# EasyEDA Pro project MN42_v2base.eprj, board MOAR_Board
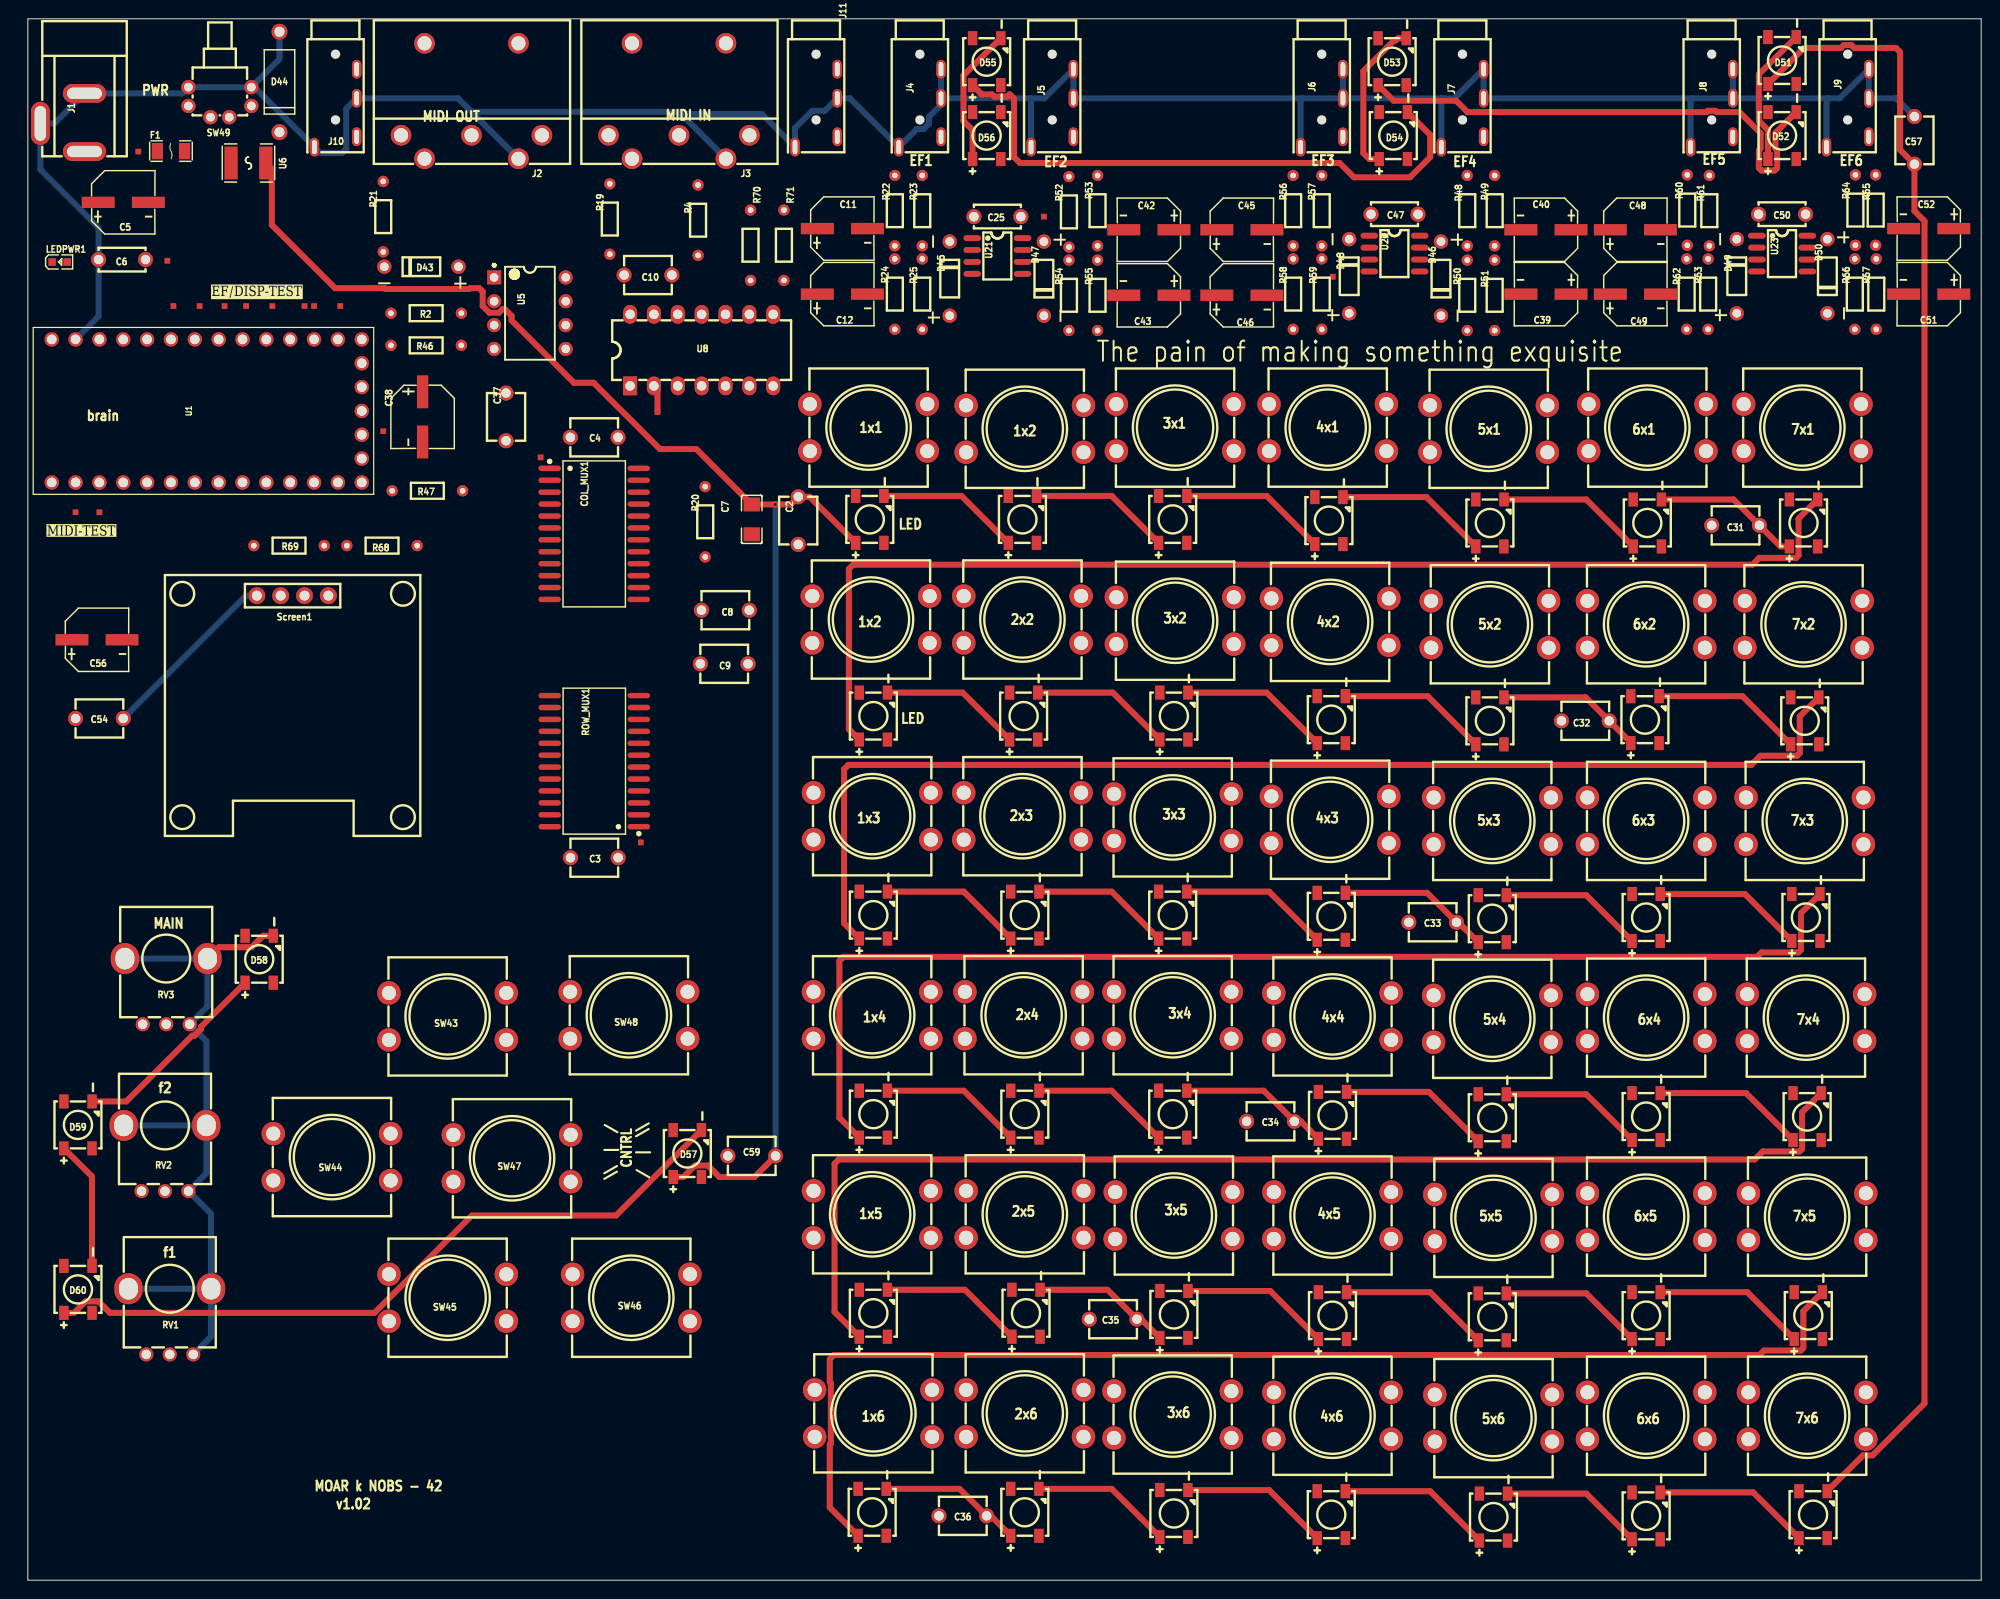
[diagram p3: board, top side]
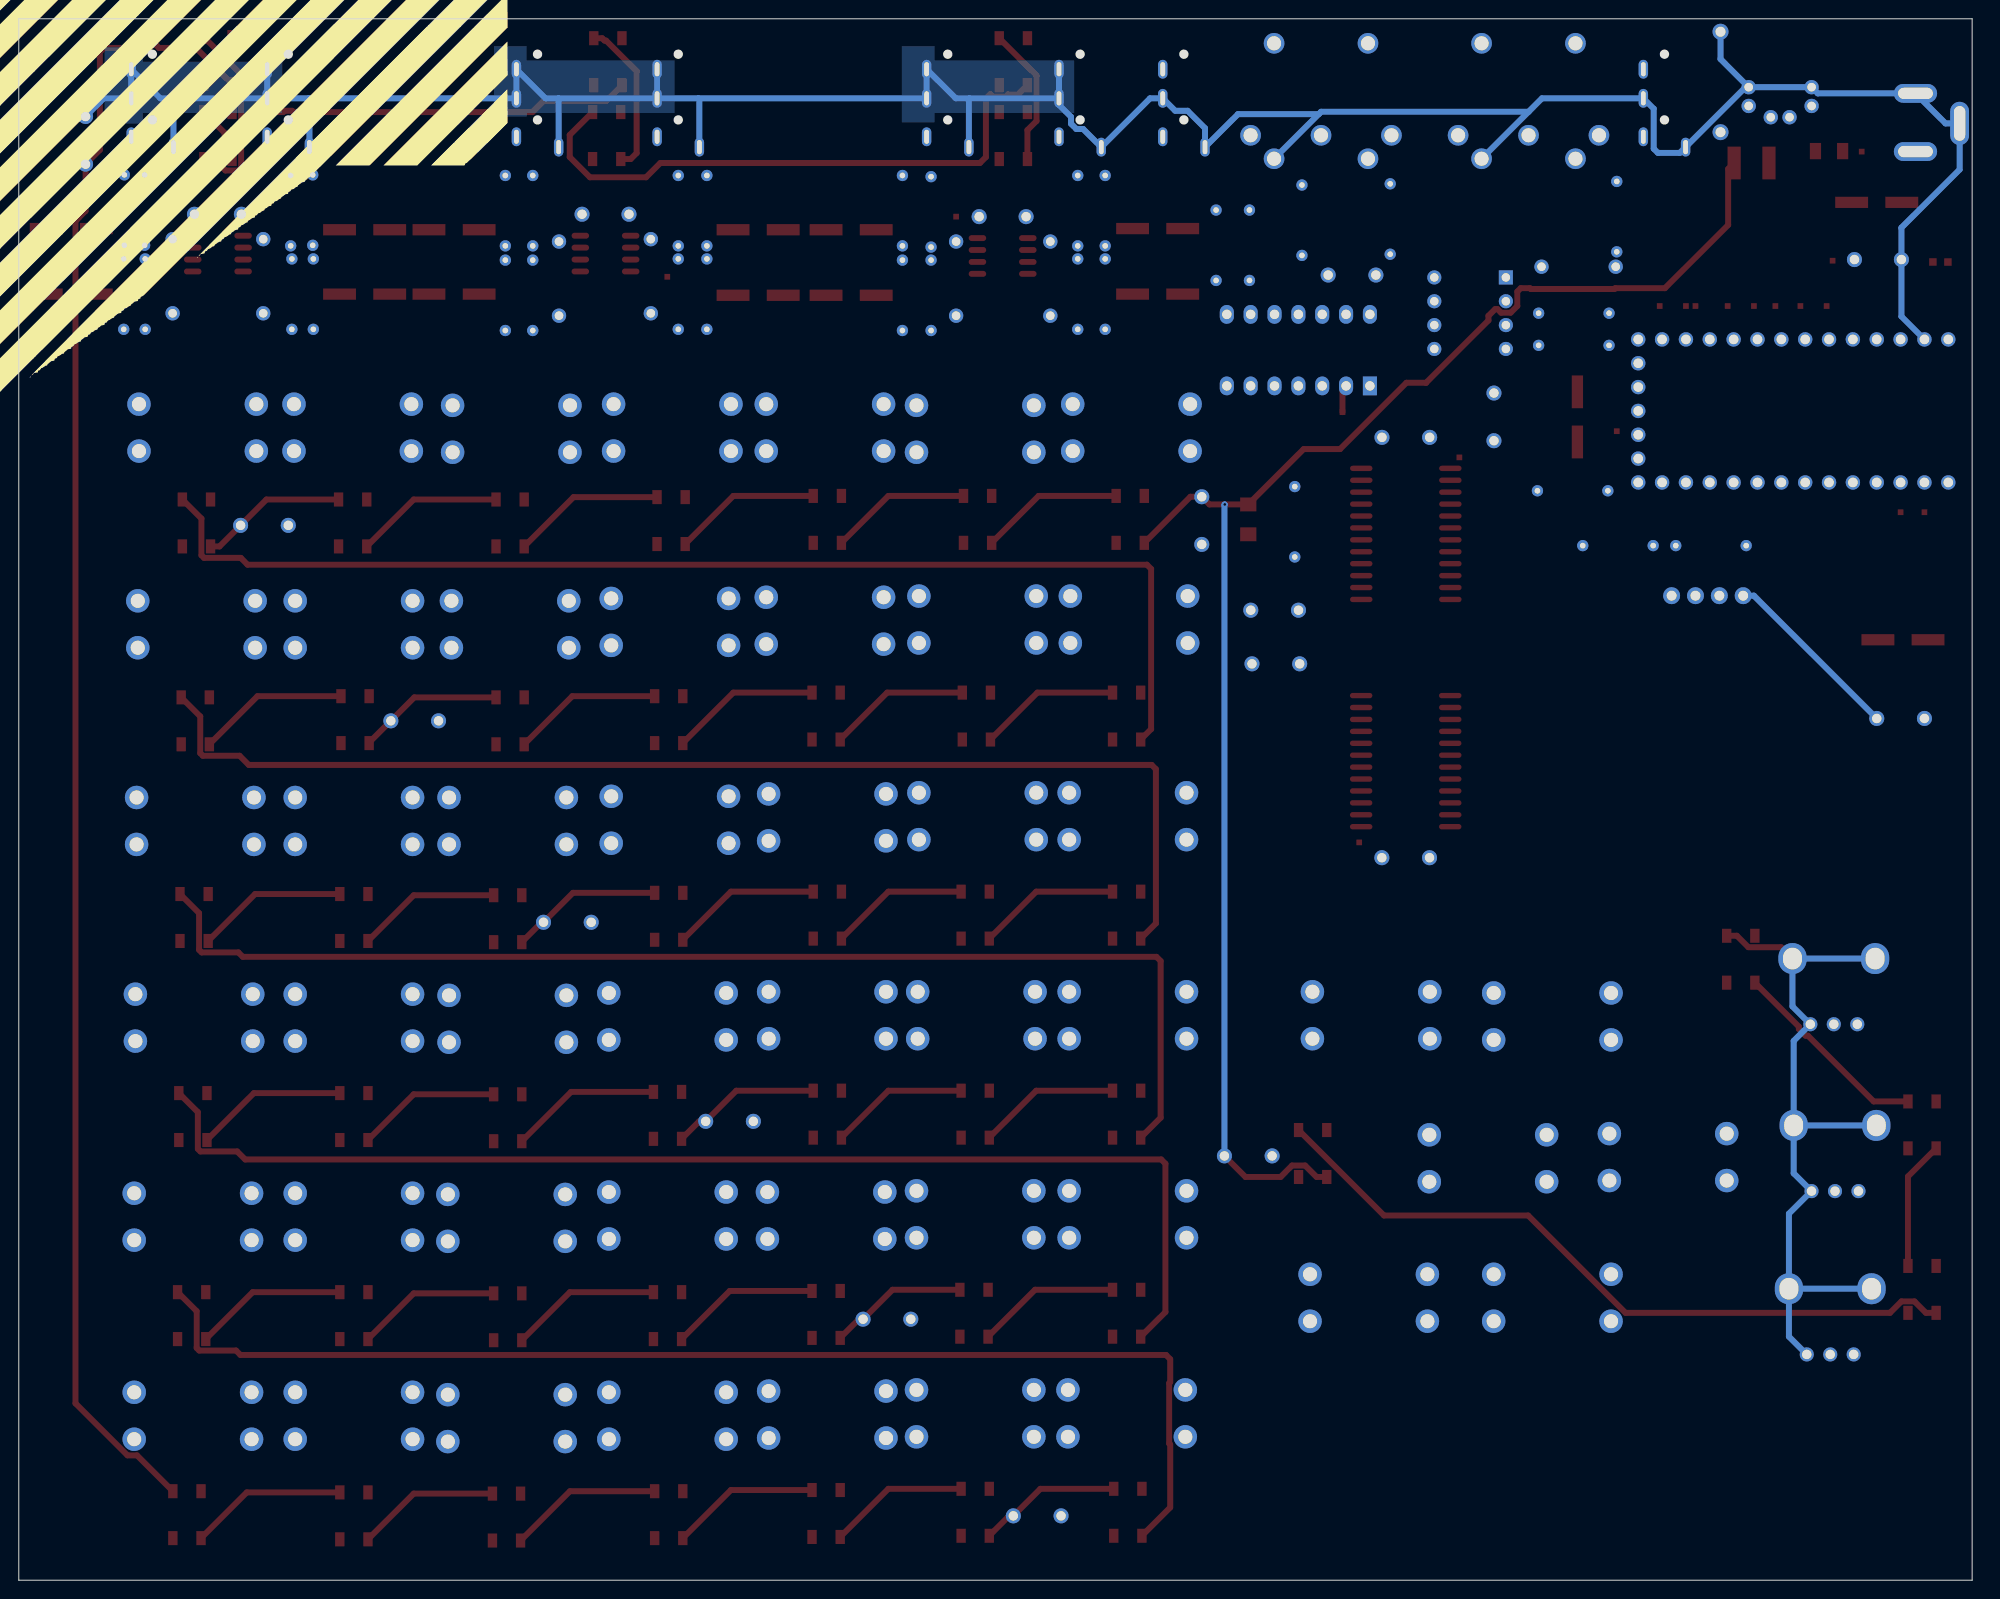
[diagram p4: board, bottom side, seen from below]

Outline 208.03 x 166.37 mm; copper layers: Top Layer, Bottom Layer. Coordinates in mm from the lower left corner of the outline.
Outline path: 0,166.37 0,0 208.03,0 208.03,166.37 0,166.37
Stack: Top Layer 0.035mm / Dielectric1 1.51mm FR4 er 4.5 / Bottom Layer 0.035mm

## Design rules (mm)
template: User Custom Config
spacing safeClearance (default): track to track 0.152, other pairs 0.152 to 0.3
track width trackWidth (default): min 0.127, default 0.254, max 2.54
differential pair differentialPair (default): width min 0.127, default 0.254, max 2.54; gap min 0.152, default 0.152
via viaSize (default): diameter min 0.5, default 0.61, max 10; hole min 0.3, default 0.305, max 5.999

## Placement (name value [footprint] x y rotation side)
C2  100nF  [CAP-TH_L5.0-W4.0-P5.00-D1.0]  82.04 112.9 270 top
C3  100nF  [CAP-TH_L5.0-W4.0-P5.00-D1.0]  60.33 76.98 0 top
C4  100nF  [CAP-TH_L5.0-W4.0-P5.00-D1.0]  60.31 121.77 0 top
C5  220uF  [CAP-SMD_BD6.3-L6.6-W6.6-FD]  10.16 146.81 0 top
C6  100nF  [CAP-TH_L5.0-W2.5-P5.00-D1.0]  10.03 140.72 0 top
C7  100uF  [C1206]  77.09 113.03 90 top
C8  1uF  [CAP-TH_L5.0-W4.0-P5.00-D1.0]  74.28 103.36 180 top
C9  100nF  [CAP-TH_L5.0-W4.0-P5.00-D1.0]  74.16 97.64 180 top
C10  100nF  [CAP-TH_L5.0-W4.0-P5.00-D1.0]  66.04 139.06 0 top
C11  1uF  [CAP-SMD_BD6.3-L6.6-W6.6-FD]  86.74 144.02 0 top
C12  1uF  [CAP-SMD_BD6.3-L6.6-W6.6-FD]  86.74 137.03 0 top
C25  100nF  [CAP-TH_L5.0-W2.5-P5.00-D1.0]  103.25 145.29 180 top
C31  100nF  [CAP-TH_L5.0-W4.0-P5.00-D1.0]  181.86 112.4 180 top
C32  100nF  [CAP-TH_L5.0-W4.0-P5.00-D1.0]  165.86 91.57 180 top
C33  100nF  [CAP-TH_L5.0-W4.0-P5.00-D1.0]  149.61 70.1 180 top
C34  100nF  [CAP-TH_L5.0-W4.0-P5.00-D1.0]  132.33 48.9 180 top
C35  100nF  [CAP-TH_L5.0-W4.0-P5.00-D1.0]  115.57 27.81 180 top
C36  100nF  [CAP-TH_L5.0-W4.0-P5.00-D1.0]  99.57 6.86 180 top
C37  100nF  [CAP-TH_L5.0-W4.0-P5.00-D1.0]  50.93 123.95 270 top
C38  4.7uF  [CAP-SMD_BD6.3-L6.6-W6.6-FD]  42.04 123.95 270 top
C39  1uF  [CAP-SMD_BD6.3-L6.6-W6.6-FD]  161.67 137.03 180 top
C40  1uF  [CAP-SMD_BD6.3-L6.6-W6.6-FD]  161.67 143.89 180 top
C42  1uF  [CAP-SMD_BD6.3-L6.6-W6.6-FD]  119.38 143.89 180 top
C43  1uF  [CAP-SMD_BD6.3-L6.6-W6.6-FD]  119.38 136.91 180 top
C45  1uF  [CAP-SMD_BD6.3-L6.6-W6.6-FD]  129.29 143.89 0 top
C46  1uF  [CAP-SMD_BD6.3-L6.6-W6.6-FD]  129.29 136.91 0 top
C47  100nF  [CAP-TH_L5.0-W2.5-P5.00-D1.0]  145.54 145.54 180 top
C48  1uF  [CAP-SMD_BD6.3-L6.6-W6.6-FD]  171.2 143.89 0 top
C49  1uF  [CAP-SMD_BD6.3-L6.6-W6.6-FD]  171.2 137.03 0 top
C50  100nF  [CAP-TH_L5.0-W2.5-P5.00-D1.0]  186.82 145.54 180 top
C51  1uF  [CAP-SMD_BD6.3-L6.6-W6.6-FD]  202.44 137.03 180 top
C52  1uF  [CAP-SMD_BD6.3-L6.6-W6.6-FD]  202.44 144.02 180 top
C54  1uF  [CAP-TH_L5.0-W4.0-P5.00-D1.0]  7.62 91.82 0 top
C56  10uF  [CAP-SMD_BD6.3-L6.6-W6.6-FD]  7.37 100.2 0 top
C57  100nF  [CAP-TH_L5.0-W4.0-P5.00-D1.0]  200.91 153.42 90 top
C59  100nF  [CAP-TH_L5.0-W4.0-P5.00-D1.0]  77.09 45.21 180 top
COL_MUX1  CD74HC4067M96  [SOIC-24_L15.4-W7.5-P1.27-LS10.3-BL]  60.31 111.48 270 top
D1  XL-5050RGBC-WS2812B  [LED-SMD_4P-L5.0-W5.0-BL_XL-5050RGBC]  89.66 113.03 0 top
D2  XL-5050RGBC-WS2812B  [LED-SMD_4P-L5.0-W5.0-BL_XL-5050RGBC]  105.92 113.03 0 top
D3  XL-5050RGBC-WS2812B  [LED-SMD_4P-L5.0-W5.0-BL_XL-5050RGBC]  121.92 113.03 0 top
D4  XL-5050RGBC-WS2812B  [LED-SMD_4P-L5.0-W5.0-BL_XL-5050RGBC]  138.56 112.9 0 top
D5  XL-5050RGBC-WS2812B  [LED-SMD_4P-L5.0-W5.0-BL_XL-5050RGBC]  155.7 112.65 0 top
D6  XL-5050RGBC-WS2812B  [LED-SMD_4P-L5.0-W5.0-BL_XL-5050RGBC]  172.47 112.65 0 top
D7  XL-5050RGBC-WS2812B  [LED-SMD_4P-L5.0-W5.0-BL_XL-5050RGBC]  189.1 112.65 0 top
D8  XL-5050RGBC-WS2812B  [LED-SMD_4P-L5.0-W5.0-BL_XL-5050RGBC]  90.04 92.08 0 top
D9  XL-5050RGBC-WS2812B  [LED-SMD_4P-L5.0-W5.0-BL_XL-5050RGBC]  106.05 92.08 0 top
D10  XL-5050RGBC-WS2812B  [LED-SMD_4P-L5.0-W5.0-BL_XL-5050RGBC]  122.05 92.08 0 top
D11  XL-5050RGBC-WS2812B  [LED-SMD_4P-L5.0-W5.0-BL_XL-5050RGBC]  138.81 91.69 0 top
D12  XL-5050RGBC-WS2812B  [LED-SMD_4P-L5.0-W5.0-BL_XL-5050RGBC]  155.7 91.57 0 top
D13  XL-5050RGBC-WS2812B  [LED-SMD_4P-L5.0-W5.0-BL_XL-5050RGBC]  172.21 91.69 0 top
D14  XL-5050RGBC-WS2812B  [LED-SMD_4P-L5.0-W5.0-BL_XL-5050RGBC]  189.23 91.57 0 top
D15  XL-5050RGBC-WS2812B  [LED-SMD_4P-L5.0-W5.0-BL_XL-5050RGBC]  90.04 70.87 0 top
D16  XL-5050RGBC-WS2812B  [LED-SMD_4P-L5.0-W5.0-BL_XL-5050RGBC]  106.17 70.87 0 top
D17  XL-5050RGBC-WS2812B  [LED-SMD_4P-L5.0-W5.0-BL_XL-5050RGBC]  121.92 70.87 0 top
D18  XL-5050RGBC-WS2812B  [LED-SMD_4P-L5.0-W5.0-BL_XL-5050RGBC]  138.81 70.74 0 top
D19  XL-5050RGBC-WS2812B  [LED-SMD_4P-L5.0-W5.0-BL_XL-5050RGBC]  155.96 70.49 0 top
D20  XL-5050RGBC-WS2812B  [LED-SMD_4P-L5.0-W5.0-BL_XL-5050RGBC]  172.34 70.61 0 top
D21  XL-5050RGBC-WS2812B  [LED-SMD_4P-L5.0-W5.0-BL_XL-5050RGBC]  189.36 70.61 0 top
D22  XL-5050RGBC-WS2812B  [LED-SMD_4P-L5.0-W5.0-BL_XL-5050RGBC]  90.04 49.66 0 top
D23  XL-5050RGBC-WS2812B  [LED-SMD_4P-L5.0-W5.0-BL_XL-5050RGBC]  106.17 49.66 0 top
D24  XL-5050RGBC-WS2812B  [LED-SMD_4P-L5.0-W5.0-BL_XL-5050RGBC]  121.92 49.66 0 top
D25  XL-5050RGBC-WS2812B  [LED-SMD_4P-L5.0-W5.0-BL_XL-5050RGBC]  138.94 49.53 0 top
D26  XL-5050RGBC-WS2812B  [LED-SMD_4P-L5.0-W5.0-BL_XL-5050RGBC]  155.96 49.28 0 top
D27  XL-5050RGBC-WS2812B  [LED-SMD_4P-L5.0-W5.0-BL_XL-5050RGBC]  172.34 49.4 0 top
D28  XL-5050RGBC-WS2812B  [LED-SMD_4P-L5.0-W5.0-BL_XL-5050RGBC]  189.48 49.4 0 top
D29  XL-5050RGBC-WS2812B  [LED-SMD_4P-L5.0-W5.0-BL_XL-5050RGBC]  90.04 28.45 0 top
D30  XL-5050RGBC-WS2812B  [LED-SMD_4P-L5.0-W5.0-BL_XL-5050RGBC]  106.3 28.45 0 top
D31  XL-5050RGBC-WS2812B  [LED-SMD_4P-L5.0-W5.0-BL_XL-5050RGBC]  122.05 28.32 0 top
D32  XL-5050RGBC-WS2812B  [LED-SMD_4P-L5.0-W5.0-BL_XL-5050RGBC]  138.94 28.19 0 top
D33  XL-5050RGBC-WS2812B  [LED-SMD_4P-L5.0-W5.0-BL_XL-5050RGBC]  155.96 28.07 0 top
D34  XL-5050RGBC-WS2812B  [LED-SMD_4P-L5.0-W5.0-BL_XL-5050RGBC]  172.34 28.19 0 top
D35  XL-5050RGBC-WS2812B  [LED-SMD_4P-L5.0-W5.0-BL_XL-5050RGBC]  189.61 28.19 0 top
D36  XL-5050RGBC-WS2812B  [LED-SMD_4P-L5.0-W5.0-BL_XL-5050RGBC]  89.92 7.24 0 top
D37  XL-5050RGBC-WS2812B  [LED-SMD_4P-L5.0-W5.0-BL_XL-5050RGBC]  106.17 7.24 0 top
D38  XL-5050RGBC-WS2812B  [LED-SMD_4P-L5.0-W5.0-BL_XL-5050RGBC]  122.05 7.11 0 top
D39  XL-5050RGBC-WS2812B  [LED-SMD_4P-L5.0-W5.0-BL_XL-5050RGBC]  138.81 6.99 0 top
D40  XL-5050RGBC-WS2812B  [LED-SMD_4P-L5.0-W5.0-BL_XL-5050RGBC]  156.08 6.73 0 top
D41  XL-5050RGBC-WS2812B  [LED-SMD_4P-L5.0-W5.0-BL_XL-5050RGBC]  172.34 6.86 0 top
D42  XL-5050RGBC-WS2812B  [LED-SMD_4P-L5.0-W5.0-BL_XL-5050RGBC]  190.12 6.99 0 top
D43  1N4148PF  [DO-35_BD1.9-L3.9-P7.90-D0.5-FD]  41.91 139.95 180 top
D44  SA6.0A  [DO-15_BD3.1-L6.7-P10.70-D0.8-RD]  26.8 159.64 90 top
D45  1N4148PF  [DO-35_BD1.9-L3.9-P7.90-D0.5-FD]  98.17 138.68 90 top
D46  1N4148PF  [DO-35_BD1.9-L3.9-P7.90-D0.5-FD]  150.5 138.68 270 top
D47  1N4148PF  [DO-35_BD1.9-L3.9-P7.90-D0.5-FD]  108.2 138.68 270 top
D48  1N4148PF  [DO-35_BD1.9-L3.9-P7.90-D0.5-FD]  140.72 138.94 90 top
D49  1N4148PF  [DO-35_BD1.9-L3.9-P7.90-D0.5-FD]  181.99 138.94 90 top
D50  1N4148PF  [DO-35_BD1.9-L3.9-P7.90-D0.5-FD]  191.64 138.94 270 top
D51  XL-5050RGBC-WS2812B  [LED-SMD_4P-L5.0-W5.0-BL_XL-5050RGBC]  186.82 161.93 0 top
D52  XL-5050RGBC-WS2812B  [LED-SMD_4P-L5.0-W5.0-BL_XL-5050RGBC]  186.82 153.92 0 top
D53  XL-5050RGBC-WS2812B  [LED-SMD_4P-L5.0-W5.0-BL_XL-5050RGBC]  145.29 161.8 0 top
D54  XL-5050RGBC-WS2812B  [LED-SMD_4P-L5.0-W5.0-BL_XL-5050RGBC]  145.42 153.92 0 top
D55  XL-5050RGBC-WS2812B  [LED-SMD_4P-L5.0-W5.0-BL_XL-5050RGBC]  102.11 161.8 0 top
D56  XL-5050RGBC-WS2812B  [LED-SMD_4P-L5.0-W5.0-BL_XL-5050RGBC]  102.11 153.92 0 top
D57  XL-5050RGBC-WS2812B  [LED-SMD_4P-L5.0-W5.0-BL_XL-5050RGBC]  70.23 45.47 0 top
D58  XL-5050RGBC-WS2812B  [LED-SMD_4P-L5.0-W5.0-BL_XL-5050RGBC]  24.64 66.17 0 top
D59  XL-5050RGBC-WS2812B  [LED-SMD_4P-L5.0-W5.0-BL_XL-5050RGBC]  5.33 48.51 0 top
D60  XL-5050RGBC-WS2812B  [LED-SMD_4P-L5.0-W5.0-BL_XL-5050RGBC]  5.33 30.99 0 top
F1  nSMD050-33V  [F1206]  15.24 152.27 0 top
J1  DC005  [DC-IN-TH_DC005]  3.68 155.32 270 top
J2  DIN-504B-M10  [CONN-TH_DIN-504B-M10]  47.24 157.61 180 top
J3  DIN-504B-M10  [CONN-TH_DIN-504B-M10]  69.34 157.61 180 top
J4  HC-PJ-320A  [AUDIO-SMD_HC-PJ-320A]  95 156.84 270 top
J5  HC-PJ-320A  [AUDIO-SMD_HC-PJ-320A]  109.09 156.84 270 top
J6  HC-PJ-320A  [AUDIO-SMD_HC-PJ-320A]  137.8 156.84 270 top
J7  HC-PJ-320A  [AUDIO-SMD_HC-PJ-320A]  152.78 156.84 270 top
J8  HC-PJ-320A  [AUDIO-SMD_HC-PJ-320A]  179.32 156.84 270 top
J9  HC-PJ-320A  [AUDIO-SMD_HC-PJ-320A]  193.8 156.84 270 top
J10  HC-PJ-320A  [AUDIO-SMD_HC-PJ-320A]  32.77 156.84 270 top
J11  HC-PJ-320A  [AUDIO-SMD_HC-PJ-320A]  83.95 156.84 270 top
LEDPWR1  -  [LED_0603]  3.43 140.46 0 top
NOREF  -  [Pad_e222]  108.2 145.29 0 top
NOREF#2  -  [Pad_e6017]  67.06 124.46 0 top
NOREF#3  -  [Pad_e229]  184.7 145.19 0 top
NOREF#4  -  [Pad_e213]  14.86 140.59 0 top
NOREF#5  -  [Pad_e234]  54.61 119.63 0 top
NOREF#6  -  [Pad_e6019]  18.29 135.76 0 top
NOREF#7  -  [Pad_e6020]  26.03 135.76 0 top
NOREF#8  -  [Pad_e6023]  33.27 135.76 0 top
NOREF#9  -  [Pad_e146]  11.76 152.22 0 top
NOREF#10  -  [Pad_e6022]  30.48 135.76 0 top
NOREF#11  -  [Pad_e6013]  5.08 113.79 0 top
NOREF#12  -  [Pad_e236]  65.28 78.61 0 top
NOREF#13  -  [Pad_e6036]  23.24 135.76 0 top
NOREF#14  -  [Pad_e6021]  29.46 135.76 0 top
NOREF#15  -  [Pad_e223]  138.96 138.88 0 top
NOREF#16  -  [Pad_e6015]  7.62 113.79 0 top
NOREF#17  -  [Pad_e6035]  20.95 135.76 0 top
NOREF#18  -  [Pad_e215]  37.85 122.43 0 top
NOREF#19  -  [Pad_e6029]  15.49 135.76 0 top
R2  4.7kΩ  [RES-TH_BD1.7-L3.5-P7.50-D0.5]  42.42 135 0 top
R4  220Ω  [RES-TH_BD1.7-L3.5-P7.50-D0.5]  71.37 144.91 270 top
R19  220Ω  [RES-TH_BD1.7-L3.5-P7.50-D0.5]  61.98 145.03 270 top
R20  33Ω  [RES-TH_BD1.7-L3.5-P7.50-D0.5]  72.14 112.78 90 top
R21  220Ω  [RES-TH_BD1.7-L3.5-P7.50-D0.5]  37.85 145.29 90 top
R22  100kΩ  [RES-TH_BD1.7-L3.5-P7.50-D0.5]  92.33 145.92 90 top
R23  10kΩ  [RES-TH_BD1.7-L3.5-P7.50-D0.5]  95.25 145.92 90 top
R24  20kΩ  [RES-TH_BD1.7-L3.5-P7.50-D0.5]  92.33 137.03 90 top
R25  4.7kΩ  [RES-TH_BD1.7-L3.5-P7.50-D0.5]  95.25 137.03 270 top
R46  100kΩ  [RES-TH_BD1.7-L3.5-P7.50-D0.5]  42.42 131.57 0 top
R47  100kΩ  [RES-TH_BD1.7-L3.5-P7.50-D0.5]  42.55 116.08 0 top
R48  100kΩ  [RES-TH_BD1.7-L3.5-P7.50-D0.5]  153.29 145.92 90 top
R49  10kΩ  [RES-TH_BD1.7-L3.5-P7.50-D0.5]  156.21 145.92 90 top
R50  20kΩ  [RES-TH_BD1.7-L3.5-P7.50-D0.5]  153.29 136.91 90 top
R51  4.7kΩ  [RES-TH_BD1.7-L3.5-P7.50-D0.5]  156.21 136.91 90 top
R52  100kΩ  [RES-TH_BD1.7-L3.5-P7.50-D0.5]  110.87 145.8 90 top
R53  10kΩ  [RES-TH_BD1.7-L3.5-P7.50-D0.5]  113.92 145.92 270 top
R54  20kΩ  [RES-TH_BD1.7-L3.5-P7.50-D0.5]  110.87 136.91 90 top
R55  4.7kΩ  [RES-TH_BD1.7-L3.5-P7.50-D0.5]  113.92 136.91 270 top
R56  100kΩ  [RES-TH_BD1.7-L3.5-P7.50-D0.5]  134.75 145.92 90 top
R57  10kΩ  [RES-TH_BD1.7-L3.5-P7.50-D0.5]  137.8 145.92 90 top
R58  20kΩ  [RES-TH_BD1.7-L3.5-P7.50-D0.5]  134.75 137.03 90 top
R59  4.7kΩ  [RES-TH_BD1.7-L3.5-P7.50-D0.5]  137.8 137.03 90 top
R60  100kΩ  [RES-TH_BD1.7-L3.5-P7.50-D0.5]  176.72 145.99 90 top
R61  10kΩ  [RES-TH_BD1.7-L3.5-P7.50-D0.5]  179.07 145.92 90 top
R62  20kΩ  [RES-TH_BD1.7-L3.5-P7.50-D0.5]  176.66 137.03 90 top
R63  4.7kΩ  [RES-TH_BD1.7-L3.5-P7.50-D0.5]  178.94 137.03 90 top
R64  100kΩ  [RES-TH_BD1.7-L3.5-P7.50-D0.5]  194.63 145.99 90 top
R65  10kΩ  [RES-TH_BD1.7-L3.5-P7.50-D0.5]  196.79 145.99 90 top
R66  20kΩ  [RES-TH_BD1.7-L3.5-P7.50-D0.5]  194.56 137.03 90 top
R67  4.7kΩ  [RES-TH_BD1.7-L3.5-P7.50-D0.5]  196.85 137.03 90 top
R68  4.7kΩ  [RES-TH_BD1.7-L3.5-P7.50-D0.5]  37.72 110.24 0 top
R69  4.7kΩ  [RES-TH_BD1.7-L3.5-P7.50-D0.5]  27.81 110.24 0 top
R70  220Ω  [RES-TH_BD1.7-L3.5-P7.50-D0.5]  76.96 142.24 270 top
R71  220Ω  [RES-TH_BD1.7-L3.5-P7.50-D0.5]  80.52 142.24 270 top
ROW_MUX1  CD74HC4067M96  [SOIC-24_L15.4-W7.5-P1.27-LS10.3-BL]  60.33 87.27 90 top
RV1  10kΩ  [RES-ADJ-TH_RK09K1130A5R]  15.11 27.56 0 top
RV2  10kΩ  [RES-ADJ-TH_RK09K1130A5R]  14.61 44.96 0 top
RV3  10kΩ  [RES-ADJ-TH_RK09K1130A5R]  14.73 62.74 0 top
Screen1  HS96L03W2C03  [OLED-TH_L27.8-W27.2-P2.54_C9900033791]  28.19 104.9 0 top
SW1  HX B3F-4055-Y  [SW-TH_4P-L12.0-W12.0-P5.00-LS12.5]  89.54 122.81 0 top
SW2  HX B3F-4055-Y  [SW-TH_4P-L12.0-W12.0-P5.00-LS12.5]  106.17 122.68 0 top
SW3  HX B3F-4055-Y  [SW-TH_4P-L12.0-W12.0-P5.00-LS12.5]  122.17 122.81 180 top
SW4  HX B3F-4055-Y  [SW-TH_4P-L12.0-W12.0-P5.00-LS12.5]  138.43 122.81 180 top
SW5  HX B3F-4055-Y  [SW-TH_4P-L12.0-W12.0-P5.00-LS12.5]  155.57 122.68 180 top
SW6  HX B3F-4055-Y  [SW-TH_4P-L12.0-W12.0-P5.00-LS12.5]  172.47 122.81 180 top
SW7  HX B3F-4055-Y  [SW-TH_4P-L12.0-W12.0-P5.00-LS12.5]  188.98 122.81 180 top
SW8  HX B3F-4055-Y  [SW-TH_4P-L12.0-W12.0-P5.00-LS12.5]  89.79 102.36 180 top
SW9  HX B3F-4055-Y  [SW-TH_4P-L12.0-W12.0-P5.00-LS12.5]  105.92 102.36 180 top
SW10  HX B3F-4055-Y  [SW-TH_4P-L12.0-W12.0-P5.00-LS12.5]  122.17 102.24 180 top
SW11  HX B3F-4055-Y  [SW-TH_4P-L12.0-W12.0-P5.00-LS12.5]  138.68 102.11 180 top
SW12  HX B3F-4055-Y  [SW-TH_4P-L12.0-W12.0-P5.00-LS12.5]  155.7 101.85 180 top
SW13  HX B3F-4055-Y  [SW-TH_4P-L12.0-W12.0-P5.00-LS12.5]  172.34 101.85 180 top
SW14  HX B3F-4055-Y  [SW-TH_4P-L12.0-W12.0-P5.00-LS12.5]  189.1 101.85 180 top
SW15  HX B3F-4055-Y  [SW-TH_4P-L12.0-W12.0-P5.00-LS12.5]  89.92 81.41 180 top
SW16  HX B3F-4055-Y  [SW-TH_4P-L12.0-W12.0-P5.00-LS12.5]  105.92 81.41 180 top
SW17  HX B3F-4055-Y  [SW-TH_4P-L12.0-W12.0-P5.00-LS12.5]  121.92 81.28 180 top
SW18  HX B3F-4055-Y  [SW-TH_4P-L12.0-W12.0-P5.00-LS12.5]  138.68 81.03 180 top
SW19  HX B3F-4055-Y  [SW-TH_4P-L12.0-W12.0-P5.00-LS12.5]  155.96 80.9 180 top
SW20  HX B3F-4055-Y  [SW-TH_4P-L12.0-W12.0-P5.00-LS12.5]  172.34 80.9 180 top
SW21  HX B3F-4055-Y  [SW-TH_4P-L12.0-W12.0-P5.00-LS12.5]  189.23 80.9 180 top
SW22  HX B3F-4055-Y  [SW-TH_4P-L12.0-W12.0-P5.00-LS12.5]  89.92 60.2 180 top
SW23  HX B3F-4055-Y  [SW-TH_4P-L12.0-W12.0-P5.00-LS12.5]  106.05 60.2 180 top
SW24  HX B3F-4055-Y  [SW-TH_4P-L12.0-W12.0-P5.00-LS12.5]  121.92 60.2 180 top
SW25  HX B3F-4055-Y  [SW-TH_4P-L12.0-W12.0-P5.00-LS12.5]  138.94 60.07 180 top
SW26  HX B3F-4055-Y  [SW-TH_4P-L12.0-W12.0-P5.00-LS12.5]  155.96 59.82 180 top
SW27  HX B3F-4055-Y  [SW-TH_4P-L12.0-W12.0-P5.00-LS12.5]  172.34 59.94 180 top
SW28  HX B3F-4055-Y  [SW-TH_4P-L12.0-W12.0-P5.00-LS12.5]  189.36 59.94 180 top
SW29  HX B3F-4055-Y  [SW-TH_4P-L12.0-W12.0-P5.00-LS12.5]  89.92 38.99 180 top
SW30  HX B3F-4055-Y  [SW-TH_4P-L12.0-W12.0-P5.00-LS12.5]  106.17 38.99 180 top
SW31  HX B3F-4055-Y  [SW-TH_4P-L12.0-W12.0-P5.00-LS12.5]  122.05 38.86 180 top
SW32  HX B3F-4055-Y  [SW-TH_4P-L12.0-W12.0-P5.00-LS12.5]  138.94 38.86 180 top
SW33  HX B3F-4055-Y  [SW-TH_4P-L12.0-W12.0-P5.00-LS12.5]  156.08 38.61 180 top
SW34  HX B3F-4055-Y  [SW-TH_4P-L12.0-W12.0-P5.00-LS12.5]  172.34 38.74 180 top
SW35  HX B3F-4055-Y  [SW-TH_4P-L12.0-W12.0-P5.00-LS12.5]  189.48 38.74 180 top
SW36  HX B3F-4055-Y  [SW-TH_4P-L12.0-W12.0-P5.00-LS12.5]  90.04 17.78 180 top
SW37  HX B3F-4055-Y  [SW-TH_4P-L12.0-W12.0-P5.00-LS12.5]  106.17 17.78 180 top
SW38  HX B3F-4055-Y  [SW-TH_4P-L12.0-W12.0-P5.00-LS12.5]  121.92 17.65 180 top
SW39  HX B3F-4055-Y  [SW-TH_4P-L12.0-W12.0-P5.00-LS12.5]  138.94 17.53 180 top
SW40  HX B3F-4055-Y  [SW-TH_4P-L12.0-W12.0-P5.00-LS12.5]  156.08 17.27 180 top
SW41  HX B3F-4055-Y  [SW-TH_4P-L12.0-W12.0-P5.00-LS12.5]  172.34 17.53 180 top
SW42  HX B3F-4055-Y  [SW-TH_4P-L12.0-W12.0-P5.00-LS12.5]  189.48 17.53 180 top
SW43  HX B3F-4055-Y  [SW-TH_4P-L12.0-W12.0-P5.00-LS12.5]  44.7 60.07 180 top
SW44  HX B3F-4055-Y  [SW-TH_4P-L12.0-W12.0-P5.00-LS12.5]  32.39 45.09 180 top
SW45  HX B3F-4055-Y  [SW-TH_4P-L12.0-W12.0-P5.00-LS12.5]  44.7 30.1 180 top
SW46  HX B3F-4055-Y  [SW-TH_4P-L12.0-W12.0-P5.00-LS12.5]  64.26 30.1 180 top
SW47  HX B3F-4055-Y  [SW-TH_4P-L12.0-W12.0-P5.00-LS12.5]  51.56 44.96 180 top
SW48  HX B3F-4055-Y  [SW-TH_4P-L12.0-W12.0-P5.00-LS12.5]  64.01 60.2 180 top
SW49  TK-6580A-1  [SW-TH_TK-6580A-1]  20.45 157.48 180 top
U1  Teensy  [teensy 4.0:MODULE_DEV-15583]  19.05 124.59 90 top
U5  6N138  [DIP-8_L9.8-W6.6-P2.54-LS7.6-BL]  53.47 135 270 top
U6  1812L200/33GR  [F1812]  23.5 151 0 top
U8  SN74AHCT125N  [PDIP-14_L19.3-W6.4-P2.54-LS7.6-BL]  71.75 131.06 0 top
U21  MCP6002DRG  [SOP-8_L4.9-W3.9-P1.27-LS6.0-BL]  103.25 141.1 270 top
U22  MCP6002DRG  [SOP-8_L4.9-W3.9-P1.27-LS6.0-BL]  145.54 141.35 270 top
U23  MCP6002DRG  [SOP-8_L4.9-W3.9-P1.27-LS6.0-BL]  186.82 141.35 270 top

## Footprints (pads in the part's own frame, mm; a bottom-side part is the same pattern mirrored in y, then rotated)
AUDIO-SMD_HC-PJ-320A
  oval 2x1 hole 1.5x0.5: 1(4.15,-2.25) 2(-4.15,2.25) 3(-1.05,2.25) 4(3.05,2.25)
C1206
  rect 1.485x1.728 smd: 1(-1.593,0) 2(1.593,0)
CAP-SMD_BD6.3-L6.6-W6.6-FD
  rect 3.5x1.2 smd: 1(-2.67,0) 2(2.67,0)
CAP-TH_L5.0-W2.5-P5.00-D1.0
  round 1.6 hole 1: 1(-2.5,0) 2(2.5,0)
CAP-TH_L5.0-W4.0-P5.00-D1.0
  round 1.6 hole 1: 1(-2.54,0) 2(2.54,0)
CONN-TH_DIN-504B-M10
  round 2.2 hole 1.5: 1(-7.5,3.65) 2(-5,6.15) 3(0,3.65) 4(5,6.15) 5(7.5,3.65) 6(-5,-6.15) 7(5,-6.15)
DC-IN-TH_DC005
  oval 2x4.6 hole 1.2x3.7: 1(3.1,2.35) 2(-3.1,2.35)
  oval 4.6x2 hole 3.7x1.2: 3(0.1,-2.35)
DIP-8_L9.8-W6.6-P2.54-LS7.6-BL
  rect 1.5x1.5 hole 0.9: 1(-3.81,-3.81)
  round 1.5 hole 0.9: 2(-1.27,-3.81) 3(1.27,-3.81) 4(3.81,-3.81) 5(3.81,3.81) 6(1.27,3.81) 7(-1.27,3.81) 8(-3.81,3.81)
DO-15_BD3.1-L6.7-P10.70-D0.8-RD
  round 1.7 hole 1.06: 1(-5.35,0) 2(5.35,0)
DO-35_BD1.9-L3.9-P7.90-D0.5-FD
  round 1.524 hole 0.914: 1(-3.95,0) 2(3.95,0)
F1206
  rect 1.19x1.728 smd: 1(-1.445,0) 2(1.445,0)
F1812
  rect 1.407x3.499 smd: 1(-1.853,0) 2(1.853,0)
LED-SMD_4P-L5.0-W5.0-BL_XL-5050RGBC
  rect 1x1.5 smd: 1(-1.5,-2.5) 2(1.5,-2.5) 3(1.5,2.5) 4(-1.5,2.5)
LED_0603
  rect 0.8x0.8 smd: 1(-0.851,-0.01) 2(0.75,-0.005)
OLED-TH_L27.8-W27.2-P2.54_C9900033791
  round 1.8 hole 1.05: 1(-3.81,0) 2(-1.27,0) 3(1.27,0) 4(3.81,0)
Pad_e146
  rect 0.61x0.61 smd: TP2(0,0)
Pad_e213
  rect 0.61x0.61 smd: TP3(0,0)
Pad_e215
  rect 0.61x0.61 smd: TP4(0,0)
Pad_e222
  rect 0.61x0.61 smd: TP5(0,0)
Pad_e223
  rect 0.61x0.61 smd: TP6(0,0)
Pad_e229
  rect 0.61x0.61 smd: TP7(0,0)
Pad_e234
  rect 0.61x0.61 smd: TP8(0,0)
Pad_e236
  rect 0.61x0.61 smd: TP9(0,0)
Pad_e6013
  rect 0.61x0.61 smd: TP10(0,0)
Pad_e6015
  rect 0.61x0.61 smd: TP11(0,0)
Pad_e6017
  rect 0.61x0.61 smd: TP12(0,0)
Pad_e6019
  rect 0.61x0.61 smd: TP13(0,0)
Pad_e6020
  rect 0.61x0.61 smd: TP14(0,0)
Pad_e6021
  rect 0.61x0.61 smd: TP15(0,0)
Pad_e6022
  rect 0.61x0.61 smd: TP16(0,0)
Pad_e6023
  rect 0.61x0.61 smd: TP17(0,0)
Pad_e6029
  rect 0.61x0.61 smd: TP18(0,0)
Pad_e6035
  rect 0.61x0.61 smd: TP19(0,0)
Pad_e6036
  rect 0.61x0.61 smd: TP20(0,0)
PDIP-14_L19.3-W6.4-P2.54-LS7.6-BL
  rect 1.5x2 hole 1: 1(-7.62,-3.81)
  oval 1.5x2 hole 1: 2(-5.08,-3.81) 3(-2.54,-3.81) 4(0,-3.81) 5(2.54,-3.81) 6(5.08,-3.81) 7(7.62,-3.81) 8(7.62,3.81) 9(5.08,3.81) 10(2.54,3.81) 11(0,3.81) 12(-2.54,3.81) 13(-5.08,3.81) 14(-7.62,3.81)
RES-ADJ-TH_RK09K1130A5R
  round 1.5 hole 1: 1(-2.5,-3.5) 2(0,-3.5) 3(2.5,-3.5)
  oval 3x3.3 hole 2x2.3: 4(4.4,3.5) 5(-4.4,3.5)
RES-TH_BD1.7-L3.5-P7.50-D0.5
  round 1.2 hole 0.6: 1(-3.75,0) 2(3.75,0)
SOIC-24_L15.4-W7.5-P1.27-LS10.3-BL
  oval 0.574x2.388 smd: 1(-6.985,-4.744) 2(-5.715,-4.744) 3(-4.445,-4.744) 4(-3.175,-4.744) 5(-1.905,-4.744) 6(-0.635,-4.744) 7(0.635,-4.744) 8(1.905,-4.744) 9(3.175,-4.744) 10(4.445,-4.744) 11(5.715,-4.744) 12(6.985,-4.744) 13(6.985,4.744) 14(5.715,4.744) 15(4.445,4.744) 16(3.175,4.744) 17(1.905,4.744) 18(0.635,4.744) 19(-0.635,4.744) 20(-1.905,4.744) 21(-3.175,4.744) 22(-4.445,4.744) 23(-5.715,4.744) 24(-6.985,4.744)
SOP-8_L4.9-W3.9-P1.27-LS6.0-BL
  oval 0.63x1.865 smd: 1(-1.905,-2.683) 2(-0.635,-2.683) 3(0.635,-2.683) 4(1.905,-2.683) 5(1.905,2.683) 6(0.635,2.683) 7(-0.635,2.683) 8(-1.905,2.683)
SW-TH_4P-L12.0-W12.0-P5.00-LS12.5
  round 2.5 hole 1.5: 1(-6.25,2.5) 2(6.25,2.5) 3(-6.25,-2.5) 4(6.25,-2.5)
SW-TH_TK-6580A-1
  round 1.524 hole 0.914: 1(3.35,-1.6) 2(3.35,0.4) 3(-3.35,-1.6) 4(-3.35,0.4) 5(1,1.6) 6(-1,1.6)
teensy 4.0:MODULE_DEV-15583
  round 1.53 hole 1.02: 0(-7.62,13.97) 1(-7.62,11.43) 2(-7.62,8.89) 3(-7.62,6.35) 3.3V_1(-2.54,-16.51) 3.3V_2(7.62,11.43) 4(-7.62,3.81) 5(-7.62,1.27) 6(-7.62,-1.27) 7(-7.62,-3.81) 8(-7.62,-6.35) 9(-7.62,-8.89) 10(-7.62,-11.43) 11(-7.62,-13.97) 12(-7.62,-16.51) 13(7.62,-16.51) 14(7.62,-13.97) 15(7.62,-11.43) 16(7.62,-8.89) 17(7.62,-6.35) 18(7.62,-3.81) 19(7.62,-1.27) 20(7.62,1.27) 21(7.62,3.81) 22(7.62,6.35) 23(7.62,8.89) G1(-7.62,16.51) G2(0,-16.51) G3(7.62,13.97) ON-OFF(5.08,-16.51) PGM(2.54,-16.51) VBAT(-5.08,-16.51) VIN(7.62,16.51)

## Nets
As in the schematic, except:
VIN_FUSED: C5.2 C6.2 D44.1 F1.2 NOREF#4.TP3 SW49.4 SW49.6 U6.1
VIN_RAW: F1.1 J1.1 NOREF#9.TP2
E1: C12.1 NOREF#8.TP17 R25.2 U1.14
E2: C43.1 NOREF#10.TP16 R55.2 U1.15
E3: C46.1 NOREF#14.TP15 R59.2 U1.16
E4: C40.1 NOREF#7.TP14 R51.2 U1.17
E5: C49.1 NOREF#6.TP13 R63.2 U1.20
E6: C52.1 NOREF#19.TP18 R67.2 U1.21
LED: NOREF#2.TP12 U1.6 U8.2
MIDI_RX: NOREF#11.TP10 R2.2 U1.0 U5.6
MIDI_TX: NOREF#16.TP11 U1.1 U8.5
MRC: COL_MUX1.1 NOREF#5.TP8 U1.7
MRR: NOREF#12.TP9 ROW_MUX1.1 U1.22
SCL: NOREF#17.TP19 R68.1 R69.2 Screen1.3 U1.19
SDA: NOREF#13.TP20 R68.2 Screen1.4 U1.18
VREF: NOREF.TP5 NOREF#15.TP6 R46.2 R47.2 U21.3 U21.5 U22.3 U22.5 U23.3 U23.5
$1N66700: C37.2 C38.2 NOREF#18.TP4 R47.1 U1.3.3V_1
$2N10057: C50.2 NOREF#3.TP7 U23.8

Pads without a net: J2 1 3 6 7; J3 1 3 6 7; SW1 3 4; SW2 3 4; SW3 3 4; SW4 3 4; SW5 3 4; SW6 3 4; SW7 3 4; SW8 3 4; SW9 3 4; SW10 3 4; SW11 3 4; SW12 3 4; SW13 3 4; SW14 3 4; SW15 3 4; SW16 3 4; SW17 3 4; SW18 3 4; SW19 3 4; SW20 3 4; SW21 3 4; SW22 3 4; SW23 3 4; SW24 3 4; SW25 3 4; SW26 3 4; SW27 3 4; SW28 3 4; SW29 3 4; SW30 3 4; SW31 3 4; SW32 3 4; SW33 3 4; SW34 3 4; SW35 3 4; SW36 3 4; SW37 3 4; SW38 3 4; SW39 3 4; SW40 3 4; SW41 3 4; SW42 3 4; SW43 3 4; SW44 3 4; SW45 3 4; SW46 3 4; SW47 3 4; SW48 3 4; U1 12 13 ON-OFF PGM VBAT; U5 1 4

## Via types
v1: diameter 0.61, hole 0.305, Top Layer to Bottom Layer, 1 via

## Routing (per net, layer and track width the routed paths; a pad name or vN(x,y) marks a point on that pad's centre or on a via; arc(x,y) is an arc through that point)
GND: length 416.9
  Top Layer w0.635: RV3.4 20.34,67.45 23.83,67.45 25.05,68.67 D58.3
  Bottom Layer w0.635: D44.2 26.8,162.08 SW49.3 ; 106.79,157.9 108.24,157.9 J5.2 J5.3 135.65,157.9 ; 106.79,157.9 106.84,157.84 J5.1 ; 106.79,157.9 J4.3 ; SW49.3 24.13,159.08 J10.1 31.13,152.08 33.46,152.08 33.91,152.53 33.91,156.79 J10.3 45.81,157.9 47.24,156.46 ; SW49.3 SW49.1 16.44,158.42 J1.2 2.83,155.22 1.33,155.22 1.33,150.31 7.53,144.11 C6.1 7.53,134.66 U1.G3 ; J6.3 J6.2 ; J6.3 150.54,157.9 ; J6.3 135.65,157.9 ; 177.13,157.9 J8.3 ; 177.13,157.9 177.07,157.84 J8.1 ; 177.13,157.9 J7.3 J7.2 151.93,157.9 150.54,157.9 ; J8.3 191.61,157.9 ; J8.3 J8.2 ; 150.54,157.9 150.53,157.88 J7.1 ; 47.24,156.46 69.34,156.46 69.59,156.21 ; 47.24,156.46 J2.2 ; 69.59,156.21 J3.2 ; 69.59,156.21 78.18,156.21 81.7,152.69 81.7,154.72 83.55,156.56 84.87,156.56 J11.3 87.55,157.9 J4.1 94.68,154.62 95.4,154.62 95.97,155.19 95.97,155.92 97.25,157.19 J4.3 ; 191.61,157.9 191.55,157.84 J9.1 ; 191.61,157.9 192.95,157.9 J9.2 J9.3 198.98,157.9 C57.2 ; 19.51,31.06 19.51,39.05 RV2.3 19.01,43.36 RV2.4 ; 19.51,31.06 RV1.5 ; 19.51,31.06 19.51,25.96 RV1.3 ; Screen1.1 23.24,104.9 C54.2 ; RV3.5 RV3.4 19.13,61.14 RV3.3 19.01,57.47 RV2.4 ; J6.1 135.55,157.79 135.65,157.9 ; J4.3 J4.2 ; RV2.4 RV2.5
CNTRLLP: length 175.4
  Top Layer w0.635: D51.1 189.16,163.26 193.1,163.26 193.4,163.56 194.2,163.56 194.51,163.26 198.94,163.26 199.39,162.81 199.39,152.4 C57.1 200.91,145.89 201.99,144.81 201.99,18.85 196.45,13.31 195.44,13.31 D42.3
LED: length 3
  Top Layer w0.635: U8.2 67.06,126.87 NOREF#2.TP12
VLED: length 167.6
  Top Layer w0.635: C59.1 77.38,42.97 73.65,42.97 72.43,44.19 71.04,44.19 69.82,42.97 D57.1 ; U6.2 25.98,150.37 25.98,144.4 32.71,137.67 38,137.67 38.09,137.58 47,137.58 47.09,137.67 48.07,137.67 48.44,137.31 48.44,135.77 49.15,135.05 50.16,135.05 50.54,135.43 50.8,135.43 51.51,134.72 51.51,134.23 58.16,127.58 58.17,127.59 60.25,127.59 67.31,120.52 71.19,120.52 C7.2 v1(79.59,114.62) 81.22,114.62 C2.1 83.25,115.44 D1.1
  Bottom Layer w0.635: C59.1 79.63,114.59 v1(79.59,114.62)
$1N66299: length 15.4
  Top Layer w0.635: D27.1 165.97,51.78 D26.3
$1N66303: length 15.3
  Top Layer w0.635: D30.1 99.8,30.95 D29.3
$1N66307: length 16.3
  Top Layer w0.635: D4.3 148.95,115.4 D5.1
$1N66319: length 14.8
  Top Layer w0.635: D23.3 115.42,52.16 D24.1
$1N66323: length 15.8
  Top Layer w0.635: D3.3 131.93,115.53 D4.1
$1N66329: length 15.3
  Top Layer w0.635: D37.1 102.55,6.86 C36.1 99.23,9.74 D36.3
$1N66333: length 16
  Top Layer w0.635: D12.1 149.07,94.19 D11.3
$1N66337: length 16
  Top Layer w0.635: D32.1 132.31,30.82 D31.3
$1N66341: length 16.3
  Top Layer w0.635: D19.1 152.34,70.1 C33.1 149.01,73.24 D18.3
$1N66350: length 16
  Top Layer w0.635: D10.3 131.93,94.58 D11.1
$1N66354: length 16.1
  Top Layer w0.635: D20.3 182.86,73.11 D21.1
$1N66358: length 15.9
  Top Layer w0.635: D38.3 132.18,9.61 D39.1
$1N66363: length 16
  Top Layer w0.635: D18.1 132.18,73.37 D17.3
$1N66367: length 127.2
  Top Layer w0.635: D8.1 87.43,90.68 87.43,107.76 87.88,108.2 183.66,108.2 184.38,108.93 188.3,108.93 188.57,109.2 188.57,113.12 D7.3
$1N66371: length 15.1
  Top Layer w0.635: D10.1 115.55,94.58 D9.3
$1N66377: length 16.1
  Top Layer w0.635: D32.3 149.33,30.69 D33.1
$1N66381: length 15.2
  Top Layer w0.635: D16.1 99.67,73.37 D15.3
$1N66385: length 15.8
  Top Layer w0.635: D6.1 165.97,115.15 D5.3
$1N66393: length 131.1
  Top Layer w0.635: D36.1 85.4,7.75 85.4,14.46 85.51,14.57 85.51,20.99 85.4,21.1 85.4,23.55 85.85,24 184.42,24 184.89,24.47 188.81,24.47 189.08,24.75 189.08,28.66 D35.3
$1N66399: length 16.1
  Top Layer w0.635: D25.1 135.57,48.9 C34.1 131.61,52.16 D24.3
$1N66413: length 15.7
  Top Layer w0.635: D7.1 186.65,110.15 C31.1 181.65,115.15 D6.3
$1N66422: length 15.1
  Top Layer w0.635: D9.1 99.55,94.58 D8.3
$1N66426: length 15.3
  Top Layer w0.635: D41.1 165.97,9.23 D40.3
$1N66431: length 16.1
  Top Layer w0.635: D13.3 182.6,94.19 D14.1
$1N66437: length 15.4
  Top Layer w0.635: D33.3 165.97,30.57 D34.1
$1N66441: length 16.8
  Top Layer w0.635: D42.1 183.75,9.36 D41.3
$1N66445: length 16.2
  Top Layer w0.635: D26.1 149.2,52.03 D25.3
$1N66449: length 14.9
  Top Layer w0.635: D31.1 118.55,27.81 C35.1 114.98,30.95 D30.3
$1N66455: length 14.8
  Top Layer w0.635: D16.3 115.42,73.37 D17.1
$1N66462: length 129.4
  Top Layer w0.635: D22.1 86.42,49.28 86.42,65.97 86.87,66.42 184.17,66.42 184.64,66.89 188.55,66.89 188.83,67.17 188.83,71.08 D21.3
$1N66466: length 15.1
  Top Layer w0.635: D3.1 115.42,115.53 D2.3
$1N66470: length 15.3
  Top Layer w0.635: D1.3 99.42,115.53 D2.1
$1N66478: length 16.2
  Top Layer w0.635: D27.3 182.98,51.9 D28.1
$1N66482: length 16.3
  Top Layer w0.635: D34.3 183.11,30.69 D35.1
$1N66488: length 15.4
  Top Layer w0.635: D20.1 165.97,72.99 D19.3
$1N66496: length 15
  Top Layer w0.635: D37.3 115.42,9.74 D38.1
$1N66500: length 15.2
  Top Layer w0.635: D22.3 99.67,52.16 D23.1
$1N66504: length 16.4
  Top Layer w0.635: D39.3 149.33,9.49 D40.1
$1N66512: length 15.6
  Top Layer w0.635: D13.1 170.71,89.26 C32.1 165.9,94.07 D12.3
$1N66530: length 128
  Top Layer w0.635: D15.1 86.93,69.98 86.93,86.42 87.38,86.87 183.53,86.87 184.51,87.85 188.43,87.85 188.7,88.12 188.7,92.04 D14.3
$1N66540: length 130
  Top Layer w0.635: D28.3 188.95,49.87 188.95,45.96 188.68,45.68 184.76,45.68 183.91,44.83 86.36,44.83 85.91,44.38 85.91,28.58 D29.1
$1N66762: length 15
  Top Layer w0.635: D52.1 185.32,154.51 184.35,155.48 184.35,160.46 D51.3
$1N66766: length 55.9
  Top Layer w0.635: D52.3 186.1,154.21 186.1,152.55 186.29,152.37 186.29,150.48 186.01,150.2 184.62,150.2 184.35,150.48 184.35,152.37 184.53,152.55 184.53,154.18 182.29,156.42 179.87,156.42 179.73,156.56 178.92,156.56 178.78,156.42 153.32,156.42 152.1,157.64 145.44,157.64 D53.1
$1N66770: length 16.7
  Top Layer w0.635: D54.1 142.86,151.42 142.22,152.06 142.22,160.79 145.48,164.04 145.64,164.04 145.9,164.3 D53.3
$1N66774: length 63.3
  Top Layer w0.635: D55.1 101.6,158.31 102.68,158.31 102.91,158.08 104.3,158.08 104.53,158.31 104.58,158.31 105.03,157.86 105.03,151.64 105.66,151 139.7,151 141.22,149.48 147.19,149.48 149.35,151.64 149.35,153.99 D54.3
$1N66778: length 14.9
  Top Layer w0.635: D55.3 99.64,160.33 99.64,155.48 100.61,154.51 D56.1
$1N69466: length 77
  Top Layer w0.635: D60.1 4.92,28.49 6.14,29.71 7.53,29.71 8.75,28.49 36.91,28.49 47.28,38.86 62.63,38.86 D57.3
$1N69470: length 13.8
  Top Layer w0.635: D60.3 6.83,43.01 D59.1
$1N69481: length 21.7
  Top Layer w0.635: D58.1 18.45,58.98 18.45,58.73 17.74,58.02 17.49,58.02 10.48,51.01 D59.3

## Copper pours and planes (outline as drawn; the poured copper is in the pictures)
GND on Bottom Layer: 179.96,161.8 195.2,161.8 195.2,156.34 179.96,156.34
GND on Bottom Layer: 95.63,161.93 110.67,161.93 110.67,156.34 95.63,156.34
GND on Bottom Layer: 138.18,161.93 153.92,161.93 153.92,156.34 138.18,156.34
GND on Bottom Layer: 110.49,163.45 113.99,163.45 113.99,155.32 110.49,155.32
GND on Bottom Layer: 194.82,163.32 198.88,163.32 198.88,155.2 194.82,155.2
GND on Bottom Layer: 153.92,163.45 157.42,163.45 157.42,155.96 153.92,155.96

## Text on the board
Document Layer: MOARkNOBS-42
Top Silkscreen Layer: brain | PWR | f2 | MAIN | f1 | v1.02 | MOAR k NOBS - 42 | MIDI OUT | MIDI IN | 1x3 | 1x2 | 1x5 | 1x1 | 1x6 | 1x4 | LED | EF1 | 2x3 | 2x2 | 2x5 | 2x6 | 2x4 | EF2 | 3x3 | 3x1 | 3x2 | 3x5 | 3x6 | 3x4 | EF3 | 4x3 | 4x1 | 4x2 | 4x5 | 4x6 | 4x4 | EF4 | 5x3 | 5x1 | 5x2 | 5x5 | 5x6 | 5x4 | 6x3 | 6x1 | 6x2 | 6x5 | 6x6 | 6x4 | EF5 | 7x3 | 7x1 | 7x2 | 7x5 | 7x6 | 7x4 | EF6 | \\  |  / / CNTRL / /  |  \\ | The pain of making something exquisite | MIDI-TEST | EF/DISP-TEST
